# Altium schematic sheet FPGA_CorePeripherals.SchDoc
size A4
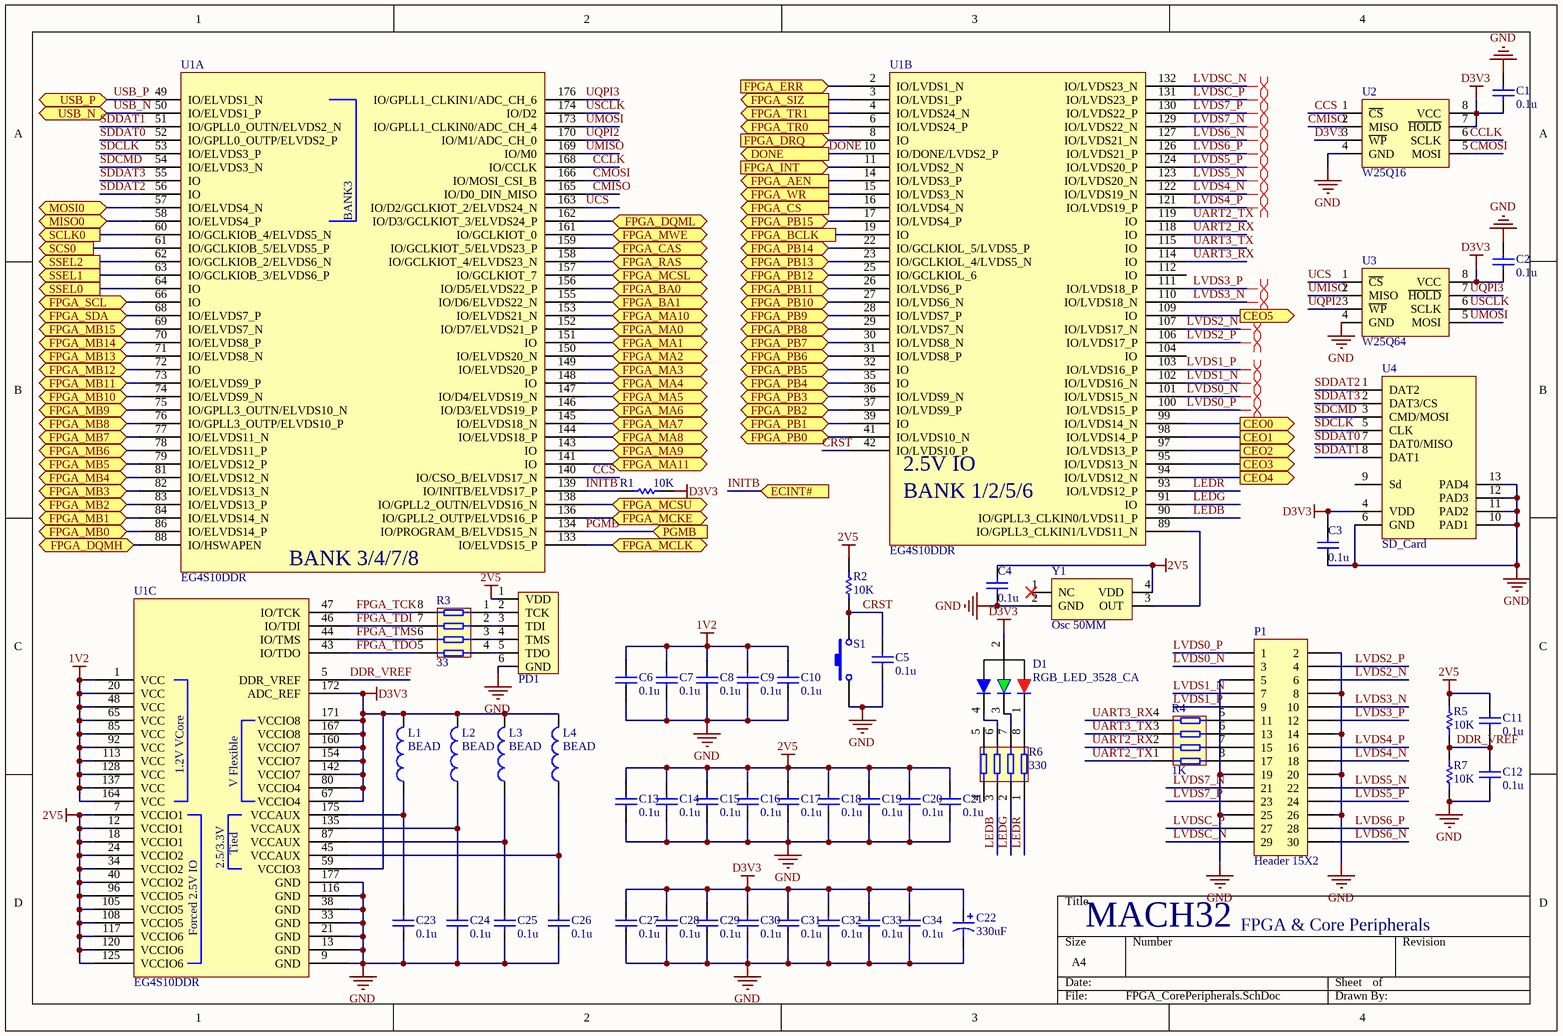
[diagram p0: FPGA_CorePeripherals.SchDoc]

## Parts
C1  value 0.1u  [0603C]  (hidden comment: Cap)
C2  value 0.1u  [0603C]  (hidden comment: Cap)
C3  value 0.1u  [0603C]  (hidden comment: Cap)
C4  value 0.1u  [0603C]  (hidden comment: Cap)
C5  value 0.1u  [0603C]  (hidden comment: Cap)
C6  value 0.1u  [0603C]  (hidden comment: Cap)
C7  value 0.1u  [0603C]  (hidden comment: Cap)
C8  value 0.1u  [0603C]  (hidden comment: Cap)
C9  value 0.1u  [0603C]  (hidden comment: Cap)
C10  value 0.1u  [0603C]  (hidden comment: Cap)
C11  value 0.1u  [0603C]  (hidden comment: Cap)
C12  value 0.1u  [0603C]  (hidden comment: Cap)
C13  value 0.1u  [0603C]  (hidden comment: Cap)
C14  value 0.1u  [0603C]  (hidden comment: Cap)
C15  value 0.1u  [0603C]  (hidden comment: Cap)
C16  value 0.1u  [0603C]  (hidden comment: Cap)
C17  value 0.1u  [0603C]  (hidden comment: Cap)
C18  value 0.1u  [0603C]  (hidden comment: Cap)
C19  value 0.1u  [0603C]  (hidden comment: Cap)
C20  value 0.1u  [0603C]  (hidden comment: Cap)
C21  value 0.1u  [0603C]  (hidden comment: Cap)
C22  value 330uF  [TanCap-1210]  (hidden comment: 330u)
C23  value 0.1u  [0603C]  (hidden comment: Cap)
C24  value 0.1u  [0603C]  (hidden comment: Cap)
C25  value 0.1u  [0603C]  (hidden comment: Cap)
C26  value 0.1u  [0603C]  (hidden comment: Cap)
C27  value 0.1u  [0603C]  (hidden comment: Cap)
C28  value 0.1u  [0603C]  (hidden comment: Cap)
C29  value 0.1u  [0603C]  (hidden comment: Cap)
C30  value 0.1u  [0603C]  (hidden comment: Cap)
C31  value 0.1u  [0603C]  (hidden comment: Cap)
C32  value 0.1u  [0603C]  (hidden comment: Cap)
C33  value 0.1u  [0603C]  (hidden comment: Cap)
C34  value 0.1u  [0603C]  (hidden comment: Cap)
D1  RGB_LED_3528_CA  [LED3528-RGB]
L1  value BEAD  [0603C]  (hidden comment: Inductor)
L2  value BEAD  [0603C]  (hidden comment: Inductor)
L3  value BEAD  [0603C]  (hidden comment: Inductor)
L4  value BEAD  [0603C]  (hidden comment: Inductor)
P1  Header 15X2  [BTB_1.27mm_2x10_SMT]
PD1  JTAG  [DBGP7]  (value not drawn)
R1  value 10K  [0603R]  (hidden comment: Res1)
R2  value 10K  [0603R]  (hidden comment: Res1)
R3  33  [YC164]
R4  1K  [YC164]
R5  value 10K  [0603R]  (hidden comment: Res1)
R6  330  [YC164]
R7  value 10K  [0603R]  (hidden comment: Res1)
S1  SW-PB  [Switch_SMT-022S-H2.5]  (value not drawn)
U1  EG4S10DDR  [EQFP176]  (parts A,B,C of 3)
U2  W25Q16  [SOP8N-127P600X200]
U3  W25Q64  [DIP8]
U4  SD_Card  [TF_self-eject]
Y1  Osc 50MM  [XTAL-3225]

## Ports
CEO0 (out), CEO1 (out), CEO2 (out), CEO3 (out), CEO4 (out), CEO5 (out), DONE (out), ECINT# (in), FPGA_AEN (out), FPGA_BA0 (bidir), FPGA_BA1 (bidir), FPGA_BCLK (out), FPGA_CAS (bidir), FPGA_CS (out), FPGA_DQMH (bidir), FPGA_DQML (bidir), FPGA_DRQ (in), FPGA_ERR (in), FPGA_INT (in), FPGA_MA0 (bidir), FPGA_MA1 (bidir), FPGA_MA2 (bidir), FPGA_MA3 (bidir), FPGA_MA4 (bidir), FPGA_MA5 (bidir), FPGA_MA6 (bidir), FPGA_MA7 (bidir), FPGA_MA8 (bidir), FPGA_MA9 (bidir), FPGA_MA10 (bidir), FPGA_MA11 (bidir), FPGA_MB0 (bidir), FPGA_MB1 (bidir), FPGA_MB2 (bidir), FPGA_MB3 (bidir), FPGA_MB4 (bidir), FPGA_MB5 (bidir), FPGA_MB6 (bidir), FPGA_MB7 (bidir), FPGA_MB8 (bidir), FPGA_MB9 (bidir), FPGA_MB10 (bidir), FPGA_MB11 (bidir), FPGA_MB12 (bidir), FPGA_MB13 (bidir), FPGA_MB14 (bidir), FPGA_MB15 (bidir), FPGA_MCKE (bidir), FPGA_MCLK (bidir), FPGA_MCSL (bidir), FPGA_MCSU (bidir), FPGA_MWE (bidir), FPGA_PB0 (bidir), FPGA_PB1 (bidir), FPGA_PB2 (bidir), FPGA_PB3 (bidir), FPGA_PB4 (bidir), FPGA_PB5 (bidir), FPGA_PB6 (bidir), FPGA_PB7 (bidir), FPGA_PB8 (bidir), FPGA_PB9 (bidir), FPGA_PB10 (bidir), FPGA_PB11 (bidir), FPGA_PB12 (bidir), FPGA_PB13 (bidir), FPGA_PB14 (bidir), FPGA_PB15 (bidir), FPGA_RAS (bidir), FPGA_SCL (bidir), FPGA_SDA (bidir), FPGA_SIZ (out), FPGA_TR0 (out), FPGA_TR1 (out), FPGA_WR (out), MISO0 (bidir), MOSI0 (bidir), PGMB (in), SCLK0 (out), SCS0 (out), SSEL0 (out), SSEL1 (out), SSEL2 (out), USB_N (bidir), USB_P (bidir)

## Nets
1V2: C6.1 C7.1 C8.1 C9.1 C10.1 U1.1(VCC) U1.20(VCC) U1.48(VCC) U1.65(VCC) U1.85(VCC) U1.92(VCC) U1.113(VCC) U1.128(VCC) U1.137(VCC) U1.164(VCC)
2V5: C4.2 C11.1 C13.1 C14.1 C15.1 C16.1 C17.1 C18.1 C19.1 C20.1 C21.1 PD1.1(VDD) R2.2 R5.1 U1.7(VCCIO1) U1.12(VCCIO1) U1.18(VCCIO1) U1.24(VCCIO2) U1.34(VCCIO2) U1.40(VCCIO2) U1.96(VCCIO5) U1.105(VCCIO5) U1.108(VCCIO5) U1.117(VCCIO6) U1.120(VCCIO6) U1.125(VCCIO6) Y1.4(VDD)
D3V3: C1.2 C2.2 C3.2 C22.1 C27.1 C28.1 C29.1 C30.1 C31.1 C32.1 C33.1 C34.1 D1.2 L1.2 L2.2 L3.2 L4.2 R1.2 U1.59(VCCIO3) U1.67(VCCIO4) U1.80(VCCIO4) U1.142(VCCIO7) U1.154(VCCIO7) U1.160(VCCIO7) U1.167(VCCIO8) U1.171(VCCIO8) U1.172(ADC_REF) U2.3(~{WP}) U2.7(~{HOLD}) U2.8(VCC) U3.8(VCC) U4.4(VDD)
GND: C1.1 C2.1 C3.1 C4.1 C5.2 C6.2 C7.2 C8.2 C9.2 C10.2 C12.2 C13.2 C14.2 C15.2 C16.2 C17.2 C18.2 C19.2 C20.2 C21.2 C22.2 C23.2 C24.2 C25.2 C26.2 C27.2 C28.2 C29.2 C30.2 C31.2 C32.2 C33.2 C34.2 P1.2 P1.5 P1.8 P1.14 P1.19 P1.20 P1.25 P1.26 PD1.6(GND) R7.2 S1.1 U1.9(GND) U1.13(GND) U1.21(GND) U1.33(GND) U1.38(GND) U1.116(GND) U1.177(GND) U2.4(GND) U3.4(GND) U4.6(GND) U4.10(PAD1) U4.11(PAD2) U4.12(PAD3) U4.13(PAD4) Y1.2(GND)
CCLK: U1.168(IO/CCLK) U2.6(SCLK)
CCS: U1.140(IO/CSO_B/ELVDS17_N) U2.1(~{CS})
CEO0: U1.99(IO/LVDS14_N) ; port CEO0
CEO1: U1.98(IO/LVDS14_P) ; port CEO1
CEO2: U1.97(IO/LVDS13_P) ; port CEO2
CEO3: U1.95(IO/LVDS13_N) ; port CEO3
CEO4: U1.94(IO/LVDS12_N) ; port CEO4
CEO5: U1.109(IO) ; port CEO5
CMISO: U1.165(IO/D0_DIN_MISO) U2.2(MISO)
CMOSI: U1.166(IO/MOSI_CSI_B) U2.5(MOSI)
CRST: C5.1 R2.1 S1.2 U1.42(IO/LVDS10_P)
DDR_VREF: C11.2 C12.1 R5.2 R7.1 U1.5(DDR_VREF)
DONE: U1.10(IO/DONE/LVDS2_P) ; port DONE
FPGA_AEN: U1.14(IO/LVDS3_P) ; port FPGA_AEN
FPGA_BA0: U1.156(IO/D5/ELVDS22_P) ; port FPGA_BA0
FPGA_BA1: U1.155(IO/D6/ELVDS22_N) ; port FPGA_BA1
FPGA_BCLK: U1.19(IO) ; port FPGA_BCLK
FPGA_CAS: U1.159(IO/GCLKIOT_5/ELVDS23_P) ; port FPGA_CAS
FPGA_CS: U1.16(IO/LVDS4_N) ; port FPGA_CS
FPGA_DQMH: U1.88(IO/HSWAPEN) ; port FPGA_DQMH
FPGA_DQML: U1.162(IO/D3/GCLKIOT_3/ELVDS24_P) ; port FPGA_DQML
FPGA_DRQ: U1.8(IO) ; port FPGA_DRQ
FPGA_ERR: U1.2(IO/LVDS1_N) ; port FPGA_ERR
FPGA_INT: U1.11(IO/LVDS2_N) ; port FPGA_INT
FPGA_MA0: U1.152(IO/D7/ELVDS21_P) ; port FPGA_MA0
FPGA_MA1: U1.151(IO) ; port FPGA_MA1
FPGA_MA2: U1.150(IO/ELVDS20_N) ; port FPGA_MA2
FPGA_MA3: U1.149(IO/ELVDS20_P) ; port FPGA_MA3
FPGA_MA4: U1.148(IO) ; port FPGA_MA4
FPGA_MA5: U1.147(IO/D4/ELVDS19_N) ; port FPGA_MA5
FPGA_MA6: U1.146(IO/D3/ELVDS19_P) ; port FPGA_MA6
FPGA_MA7: U1.145(IO/ELVDS18_N) ; port FPGA_MA7
FPGA_MA8: U1.144(IO/ELVDS18_P) ; port FPGA_MA8
FPGA_MA9: U1.143(IO) ; port FPGA_MA9
FPGA_MA10: U1.153(IO/ELVDS21_N) ; port FPGA_MA10
FPGA_MA11: U1.141(IO) ; port FPGA_MA11
FPGA_MB0: U1.86(IO/ELVDS14_P) ; port FPGA_MB0
FPGA_MB1: U1.84(IO/ELVDS14_N) ; port FPGA_MB1
FPGA_MB2: U1.83(IO/ELVDS13_P) ; port FPGA_MB2
FPGA_MB3: U1.82(IO/ELVDS13_N) ; port FPGA_MB3
FPGA_MB4: U1.81(IO/ELVDS12_N) ; port FPGA_MB4
FPGA_MB5: U1.79(IO/ELVDS12_P) ; port FPGA_MB5
FPGA_MB6: U1.78(IO/ELVDS11_P) ; port FPGA_MB6
FPGA_MB7: U1.77(IO/ELVDS11_N) ; port FPGA_MB7
FPGA_MB8: U1.76(IO/GPLL3_OUTP/ELVDS10_P) ; port FPGA_MB8
FPGA_MB9: U1.75(IO/GPLL3_OUTN/ELVDS10_N) ; port FPGA_MB9
FPGA_MB10: U1.74(IO/ELVDS9_N) ; port FPGA_MB10
FPGA_MB11: U1.73(IO/ELVDS9_P) ; port FPGA_MB11
FPGA_MB12: U1.72(IO) ; port FPGA_MB12
FPGA_MB13: U1.71(IO/ELVDS8_N) ; port FPGA_MB13
FPGA_MB14: U1.70(IO/ELVDS8_P) ; port FPGA_MB14
FPGA_MB15: U1.69(IO/ELVDS7_N) ; port FPGA_MB15
FPGA_MCKE: U1.136(IO/GPLL2_OUTP/ELVDS16_P) ; port FPGA_MCKE
FPGA_MCLK: U1.133(IO/ELVDS15_P) ; port FPGA_MCLK
FPGA_MCSL: U1.157(IO/GCLKIOT_7) ; port FPGA_MCSL
FPGA_MCSU: U1.138(IO/GPLL2_OUTN/ELVDS16_N) ; port FPGA_MCSU
FPGA_MWE: U1.161(IO/GCLKIOT_0) ; port FPGA_MWE
FPGA_PB0: U1.41(IO/LVDS10_N) ; port FPGA_PB0
FPGA_PB1: U1.39(IO) ; port FPGA_PB1
FPGA_PB2: U1.37(IO/LVDS9_P) ; port FPGA_PB2
FPGA_PB3: U1.36(IO/LVDS9_N) ; port FPGA_PB3
FPGA_PB4: U1.35(IO) ; port FPGA_PB4
FPGA_PB5: U1.32(IO) ; port FPGA_PB5
FPGA_PB6: U1.31(IO/LVDS8_P) ; port FPGA_PB6
FPGA_PB7: U1.30(IO/LVDS8_N) ; port FPGA_PB7
FPGA_PB8: U1.29(IO/LVDS7_N) ; port FPGA_PB8
FPGA_PB9: U1.28(IO/LVDS7_P) ; port FPGA_PB9
FPGA_PB10: U1.27(IO/LVDS6_N) ; port FPGA_PB10
FPGA_PB11: U1.26(IO/LVDS6_P) ; port FPGA_PB11
FPGA_PB12: U1.25(IO/GCLKIOL_6) ; port FPGA_PB12
FPGA_PB13: U1.23(IO/GCLKIOL_4/LVDS5_N) ; port FPGA_PB13
FPGA_PB14: U1.22(IO/GCLKIOL_5/LVDS5_P) ; port FPGA_PB14
FPGA_PB15: U1.17(IO/LVDS4_P) ; port FPGA_PB15
FPGA_RAS: U1.158(IO/GCLKIOT_4/ELVDS23_N) ; port FPGA_RAS
FPGA_SCL: U1.66(IO) ; port FPGA_SCL
FPGA_SDA: U1.68(IO/ELVDS7_P) ; port FPGA_SDA
FPGA_SIZ: U1.3(IO/LVDS1_P) ; port FPGA_SIZ
FPGA_TCK: R3.8 U1.47(IO/TCK)
FPGA_TDI: R3.7 U1.46(IO/TDI)
FPGA_TDO: R3.5 U1.43(IO/TDO)
FPGA_TMS: R3.6 U1.44(IO/TMS)
FPGA_TR0: U1.6(IO/LVDS24_P) ; port FPGA_TR0
FPGA_TR1: U1.4(IO/LVDS24_N) ; port FPGA_TR1
FPGA_WR: U1.15(IO/LVDS3_N) ; port FPGA_WR
INITB: R1.1 U1.139(IO/INITB/ELVDS17_P) ; port ECINT#
LEDB: R6.3 U1.90(IO/GPLL3_CLKIN0/LVDS11_P)
LEDG: R6.2 U1.91(IO)
LEDR: R6.1 U1.93(IO/LVDS12_P)
LVDS0_N: P1.3 U1.101(IO/LVDS15_N)
LVDS0_P: P1.1 U1.100(IO/LVDS15_P)
LVDS1_N: P1.7 U1.102(IO/LVDS16_N)
LVDS1_P: P1.9 U1.103(IO/LVDS16_P)
LVDS2_N: P1.6 U1.107(IO/LVDS17_N)
LVDS2_P: P1.4 U1.106(IO/LVDS17_P)
LVDS3_N: P1.10 U1.110(IO/LVDS18_N)
LVDS3_P: P1.12 U1.111(IO/LVDS18_P)
LVDS4_N: P1.18 U1.122(IO/LVDS19_N)
LVDS4_P: P1.16 U1.121(IO/LVDS19_P)
LVDS5_N: P1.22 U1.123(IO/LVDS20_N)
LVDS5_P: P1.24 U1.124(IO/LVDS20_P)
LVDS6_N: P1.30 U1.127(IO/LVDS21_N)
LVDS6_P: P1.28 U1.126(IO/LVDS21_P)
LVDS7_N: P1.21 U1.129(IO/LVDS22_N)
LVDS7_P: P1.23 U1.130(IO/LVDS22_P)
LVDSC_N: P1.29 U1.132(IO/LVDS23_N)
LVDSC_P: P1.27 U1.131(IO/LVDS23_P)
MISO0: U1.58(IO/ELVDS4_P) ; port MISO0
MOSI0: U1.57(IO/ELVDS4_N) ; port MOSI0
PGMB: U1.134(IO/PROGRAM_B/ELVDS15_N) ; port PGMB
SCLK0: U1.60(IO/GCLKIOB_4/ELVDS5_N) ; port SCLK0
SCS0: U1.61(IO/GCLKIOB_5/ELVDS5_P) ; port SCS0
SDCLK: U1.53(IO/ELVDS3_P) U4.5(CLK)
SDCMD: U1.54(IO/ELVDS3_N) U4.3(CMD/MOSI)
SDDAT0: U1.52(IO/GPLL0_OUTP/ELVDS2_P) U4.7(DAT0/MISO)
SDDAT1: U1.51(IO/GPLL0_OUTN/ELVDS2_N) U4.8(DAT1)
SDDAT2: U1.56(IO) U4.1(DAT2)
SDDAT3: U1.55(IO) U4.2(DAT3/CS)
SSEL0: U1.64(IO) ; port SSEL0
SSEL1: U1.63(IO/GCLKIOB_3/ELVDS6_P) ; port SSEL1
SSEL2: U1.62(IO/GCLKIOB_2/ELVDS6_N) ; port SSEL2
UART2_RX: R4.2 U1.118(IO)
UART2_TX: R4.1 U1.119(IO)
UART3_RX: R4.4 U1.114(IO)
UART3_TX: R4.3 U1.115(IO)
UCS: U1.163(IO/D2/GCLKIOT_2/ELVDS24_N) U3.1(~{CS})
UMISO: U1.169(IO/M0) U3.2(MISO)
UMOSI: U1.173(IO/GPLL1_CLKIN0/ADC_CH_4) U3.5(MOSI)
UQPI2: U1.170(IO/M1/ADC_CH_0) U3.3(~{WP})
UQPI3: U1.176(IO/GPLL1_CLKIN1/ADC_CH_6) U3.7(~{HOLD})
USB_N: U1.50(IO/ELVDS1_P) ; port USB_N
USB_P: U1.49(IO/ELVDS1_N) ; port USB_P
USCLK: U1.174(IO/D2) U3.6(SCLK)
NetC23_1: C23.1 L1.1 U1.175(VCCAUX)
NetC24_1: C24.1 L2.1 U1.135(VCCAUX)
NetC25_1: C25.1 L3.1 U1.87(VCCAUX)
NetC26_1: C26.1 L4.1 U1.45(VCCAUX)
NetD1_1: D1.1 R6.8
NetD1_3: D1.3 R6.7
NetD1_4: D1.4 R6.6
NetP1_11: P1.11 R4.5
NetP1_13: P1.13 R4.6
NetP1_15: P1.15 R4.7
NetP1_17: P1.17 R4.8
NetPD1_2: PD1.2(TCK) R3.1
NetPD1_3: PD1.3(TDI) R3.2
NetPD1_4: PD1.4(TMS) R3.3
NetPD1_5: PD1.5(TDO) R3.4
NetU1_89: U1.89(IO/GPLL3_CLKIN1/LVDS11_N) Y1.3(OUT)

Not connected (* = marked no-connect by the designer): R6 4 5; U1 104(IO) 112(IO); U4 9(Sd); Y1 1(NC)*

## Layout directives
differential pair: LVDS0_N, LVDS0_P, LVDS1_N, LVDS1_P, LVDS2_N, LVDS2_P, LVDS3_N, LVDS3_P, LVDS4_N, LVDS4_P, LVDS5_N, LVDS5_P, LVDS6_N, LVDS6_P, LVDS7_N, LVDS7_P, LVDSC_N, LVDSC_P

## Notes on the sheet
- MACH32
- FPGA & Core Peripherals
- (in symbol EG4S10DDR, part A) BANK3; BANK 3/4/7/8
- (in symbol EG4S10DDR, part B) 2.5V IO; BANK 1/2/5/6
- (in symbol EG4S10DDR, part C) 1.2V VCore; V Flexible; Tied; 2.5/3.3V; Forced 2.5V IO

## Library data of the parts
C1-C21 C23-C34 = Cap: Capacitor; Published: 8-Jun-2000; LatestRevisionDate: 17-Jul-2002; LatestRevisionNote: Re-released for DXP Platform.; PackageReference: RAD-0.3; Publisher: Altium Limited; PackageDescription: Radial Cap, Thru-Hole; 2 Leads; 0.3 in Pin Spacing
C22 = Cap Pol1: Polarized Capacitor (Radial); Published: 8-Jun-2000; LatestRevisionDate: 17-Jul-2002; LatestRevisionNote: Re-released for DXP Platform.; PackageReference: RB7.6-15; Publisher: Altium Limited; PackageDescription: Polarized Capacitor (Radial); 2 Leads
D1 = LED3-CA
L1-L4 = Inductor: Code_IEC: 1005; Published: 8-Jun-2000; LatestRevisionDate: 29-May-2009; LatestRevisionNote: IPC-7351 Footprint Added.; PackageReference: 0402-A; Publisher: Altium Limited; PackageDescription: Chip Inductor; Code_JEITA: 0402
P1 = Header 15X2: Header, 15-Pin, Dual row; LatestRevisionDate: 17-Jul-2002; LatestRevisionNote: Re-released for DXP Platform.; Publisher: Altium Limited
R1 R2 R5 R7 = Res1: Resistor; Published: 8-Jun-2000; LatestRevisionDate: 17-Jul-2002; LatestRevisionNote: Re-released for DXP Platform.; PackageReference: AXIAL-0.3; Publisher: Altium Limited; PackageDescription: Axial Device, Thru-Hole; 2 Leads; 0.3 in Pin Spacing
R3 R4 R6 = ResPak-8P4R
S1 = SW-PB: Switch; Published: 24-Mar-1999; LatestRevisionDate: 17-Jul-2002; LatestRevisionNote: Re-released for DXP Platform.; PackageReference: SPST-2; Publisher: Altium Limited; PackageDescription: Switch; 2 Leads
U2 = W25Qxx: Bitstream
U3 = W25Qxx: Bootloader
Y1 = OSC